# EAGLE design RomBoard (EAGLE 5.11)

## Sheet 1 of 2
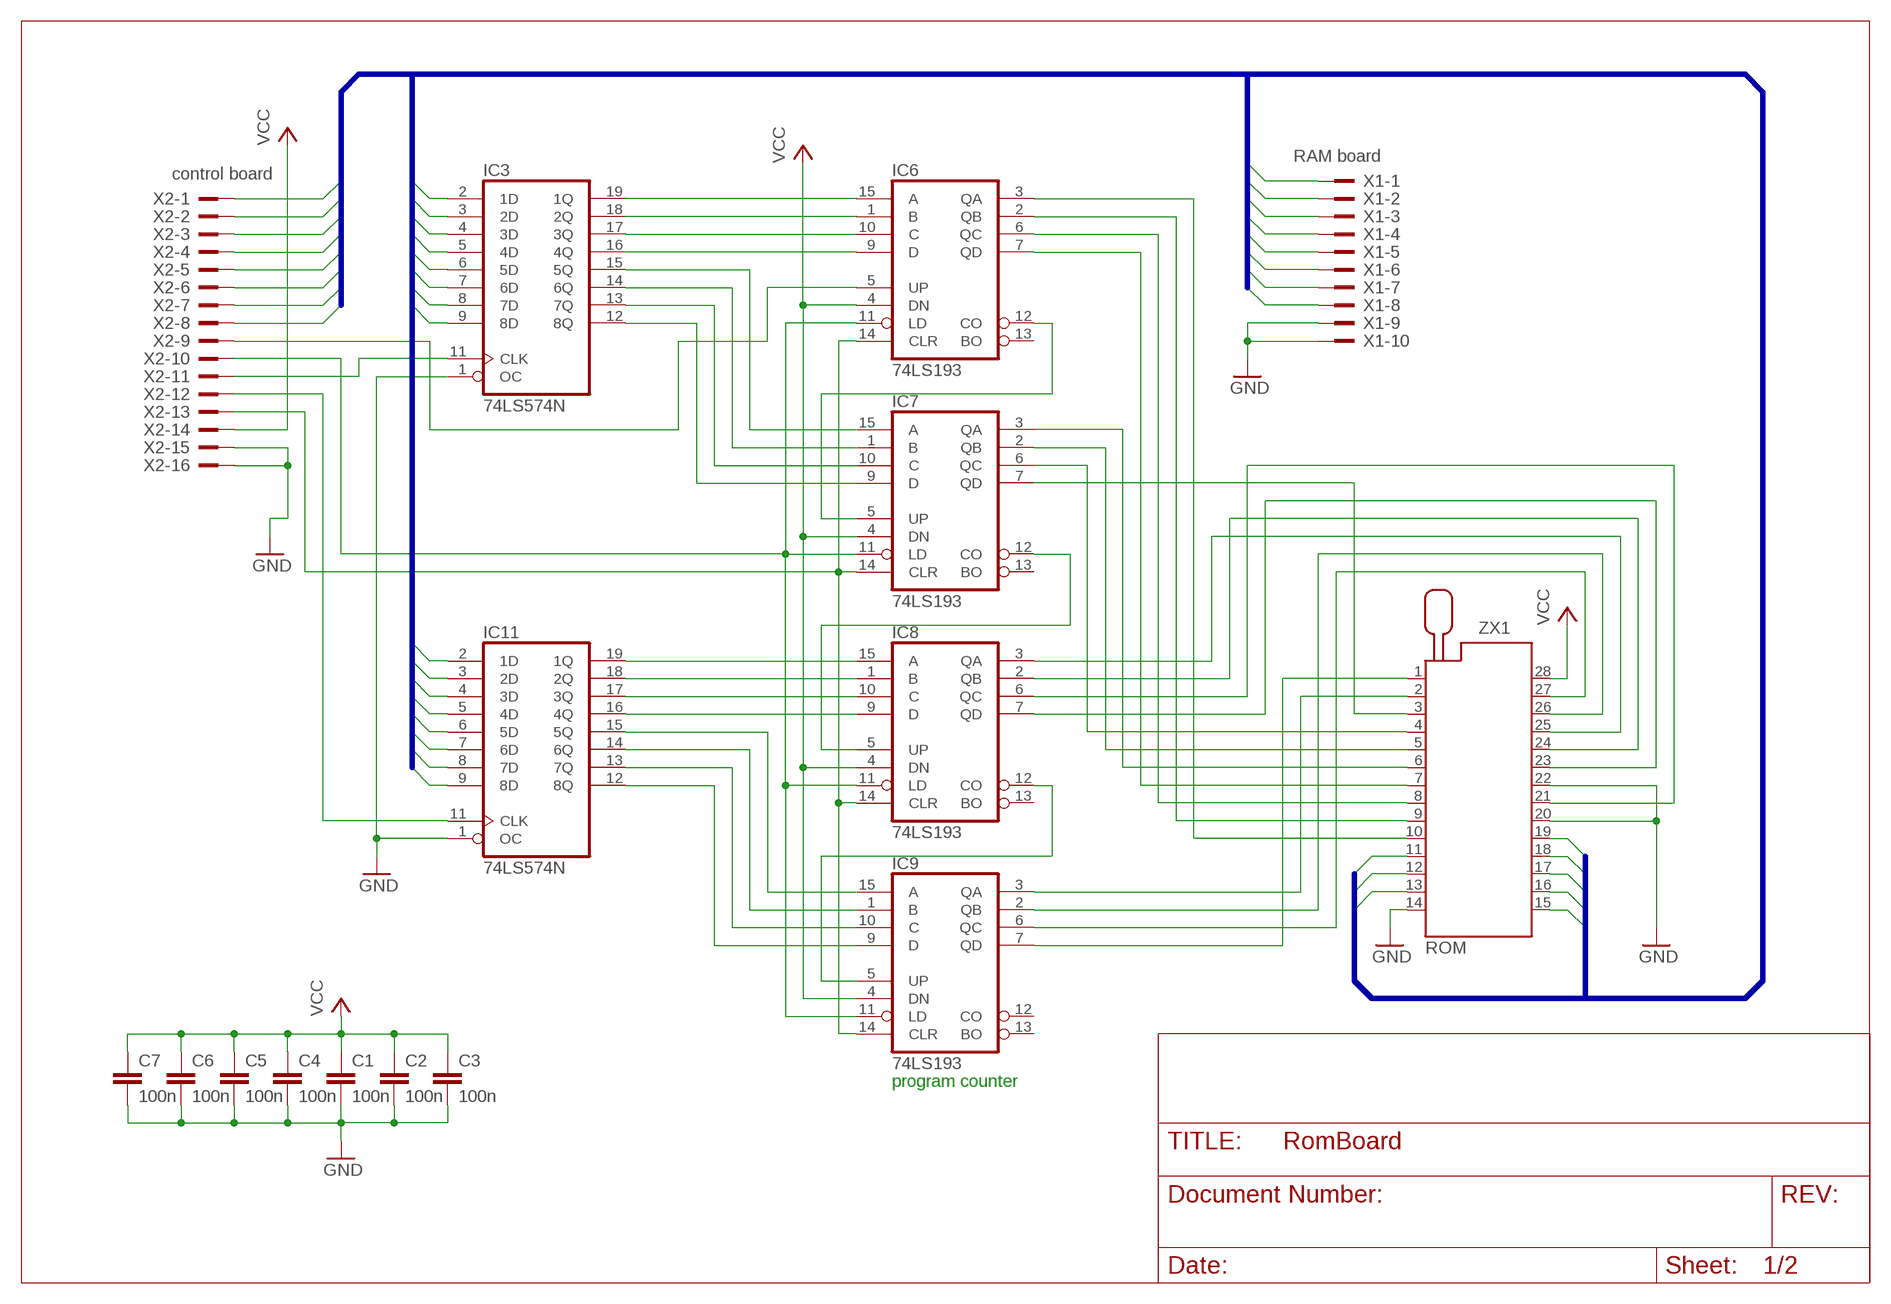
[diagram p0: schematic, sheet 1]

### Parts
C1  100n  C-EU050-025X075  [C050-025X075]
C2  100n  C-EU050-025X075  [C050-025X075]
C3  100n  C-EU050-025X075  [C050-025X075]
C4  100n  C-EU050-025X075  [C050-025X075]
C5  100n  C-EU050-025X075  [C050-025X075]
C6  100n  C-EU050-025X075  [C050-025X075]
C7  100n  C-EU050-025X075  [C050-025X075]
IC3  74LS574N  74AS574N  [DIL20]
IC6  74LS193  74192N  [DIL16]
IC7  74LS193  74192N  [DIL16]
IC8  74LS193  74192N  [DIL16]
IC9  74LS193  74192N  [DIL16]
IC11  74LS574N  74AS574N  [DIL20]
X1  RAM board  2510-  [PAK100/2500-10]
X2  control board  2516-  [PAK100/2500-16]
ZX1  ROM  228-1277-00-0602J  [228-1277-00-0602J]

### Nets
/LOAD_PC: IC6.11(LD) IC7.11(LD) IC8.11(LD) IC9.11(LD) X2.10
GND: C1.2 C2.2 C3.2 C4.2 C5.2 C6.2 C7.2 IC3.1(OC) IC11.1(OC) X1.9 X1.10 X2.15 X2.16 ZX1.14 ZX1.20 ZX1.22
INC_PC: IC6.5(UP) X2.9
LOAD_PCREG0: IC3.11(CLK) X2.11
LOAD_PCREG1: IC11.11(CLK) X2.12
N$15: IC6.12(CO) IC7.5(UP)
N$16: IC7.12(CO) IC8.5(UP)
N$22: IC8.12(CO) IC9.5(UP)
N$35: IC3.19(1Q) IC6.15(A)
N$36: IC3.18(2Q) IC6.1(B)
N$37: IC3.17(3Q) IC6.10(C)
N$38: IC3.16(4Q) IC6.9(D)
N$39: IC3.15(5Q) IC7.15(A)
N$40: IC3.14(6Q) IC7.1(B)
N$41: IC3.13(7Q) IC7.10(C)
N$42: IC3.12(8Q) IC7.9(D)
N$43: IC8.15(A) IC11.19(1Q)
N$44: IC8.1(B) IC11.18(2Q)
N$45: IC8.10(C) IC11.17(3Q)
N$46: IC8.9(D) IC11.16(4Q)
N$47: IC9.15(A) IC11.15(5Q)
N$48: IC9.1(B) IC11.14(6Q)
N$49: IC9.10(C) IC11.13(7Q)
N$50: IC9.9(D) IC11.12(8Q)
RESET: IC6.14(CLR) IC7.14(CLR) IC8.14(CLR) IC9.14(CLR) X2.13
ROM_A0: IC6.3(QA) ZX1.10
ROM_A1: IC6.2(QB) ZX1.9
ROM_A2: IC6.6(QC) ZX1.8
ROM_A3: IC6.7(QD) ZX1.7
ROM_A4: IC7.3(QA) ZX1.6
ROM_A5: IC7.2(QB) ZX1.5
ROM_A6: IC7.6(QC) ZX1.4
ROM_A7: IC7.7(QD) ZX1.3
ROM_A8: IC8.3(QA) ZX1.25
ROM_A9: IC8.2(QB) ZX1.24
ROM_A10: IC8.6(QC) ZX1.21
ROM_A11: IC8.7(QD) ZX1.23
ROM_A12: IC9.3(QA) ZX1.2
ROM_A13: IC9.2(QB) ZX1.26
ROM_A14: IC9.6(QC) ZX1.27
ROM_A15: IC9.7(QD) ZX1.1
ROM_O0: IC3.2(1D) IC11.2(1D) X1.1 X2.1 ZX1.11
ROM_O1: IC3.3(2D) IC11.3(2D) X1.2 X2.2 ZX1.12
ROM_O2: IC3.4(3D) IC11.4(3D) X1.3 X2.3 ZX1.13
ROM_O3: IC3.5(4D) IC11.5(4D) X1.4 X2.4 ZX1.15
ROM_O4: IC3.6(5D) IC11.6(5D) X1.5 X2.5 ZX1.16
ROM_O5: IC3.7(6D) IC11.7(6D) X1.6 X2.6 ZX1.17
ROM_O6: IC3.8(7D) IC11.8(7D) X1.7 X2.7 ZX1.18
ROM_O7: IC3.9(8D) IC11.9(8D) X1.8 X2.8 ZX1.19
VCC: C1.1 C2.1 C3.1 C4.1 C5.1 C6.1 C7.1 IC6.4(DN) IC7.4(DN) IC8.4(DN) IC9.4(DN) X2.14 ZX1.28
Unconnected: IC6.13(BO) IC7.13(BO) IC8.13(BO) IC9.12(CO) IC9.13(BO)

### Buses
ROM_O[0..7]

### Notes on the sheet
- program counter

## Sheet 2 of 2

## Power pins joined to a net without a drawn wire
GND: IC3.10(GND) IC6.8(GND) IC7.8(GND) IC8.8(GND) IC9.8(GND) IC11.10(GND)
VCC: IC3.20(VCC) IC6.16(VCC) IC7.16(VCC) IC8.16(VCC) IC9.16(VCC) IC11.20(VCC)

## Library data of the parts
C1-C7 = rcl:C-EU: CAPACITOR, European symbol
IC3 IC11 = 74xx-us:74*574: 8-bit D type FLIP FLOP bus driver
IC6-IC9 = 74xx-us:74*192: Synchronous 4-bit UP/DOWN COUNTER
X1 = con-3m:2510-: 3M (TM) Pak 100 4-Wall Header Source: 3M; MF: 3M; MPN: 2510-6002UB; OC_FARNELL: 9838244; OC_NEWARK: 46F4725
X2 = con-3m:2516-: 3M (TM) Pak 100 4-Wall Header Source: 3M; OC_FARNELL: unknown; OC_NEWARK: unknown
ZX1 = con-3m:228-?00-0602J: Zero Insertion Force Socked Source: http://www.3M.com/ehpd; MF: 3M; MPN: 228-1277-00-0602J; OC_FARNELL: 9897356; OC_NEWARK: 85K7825

## Board
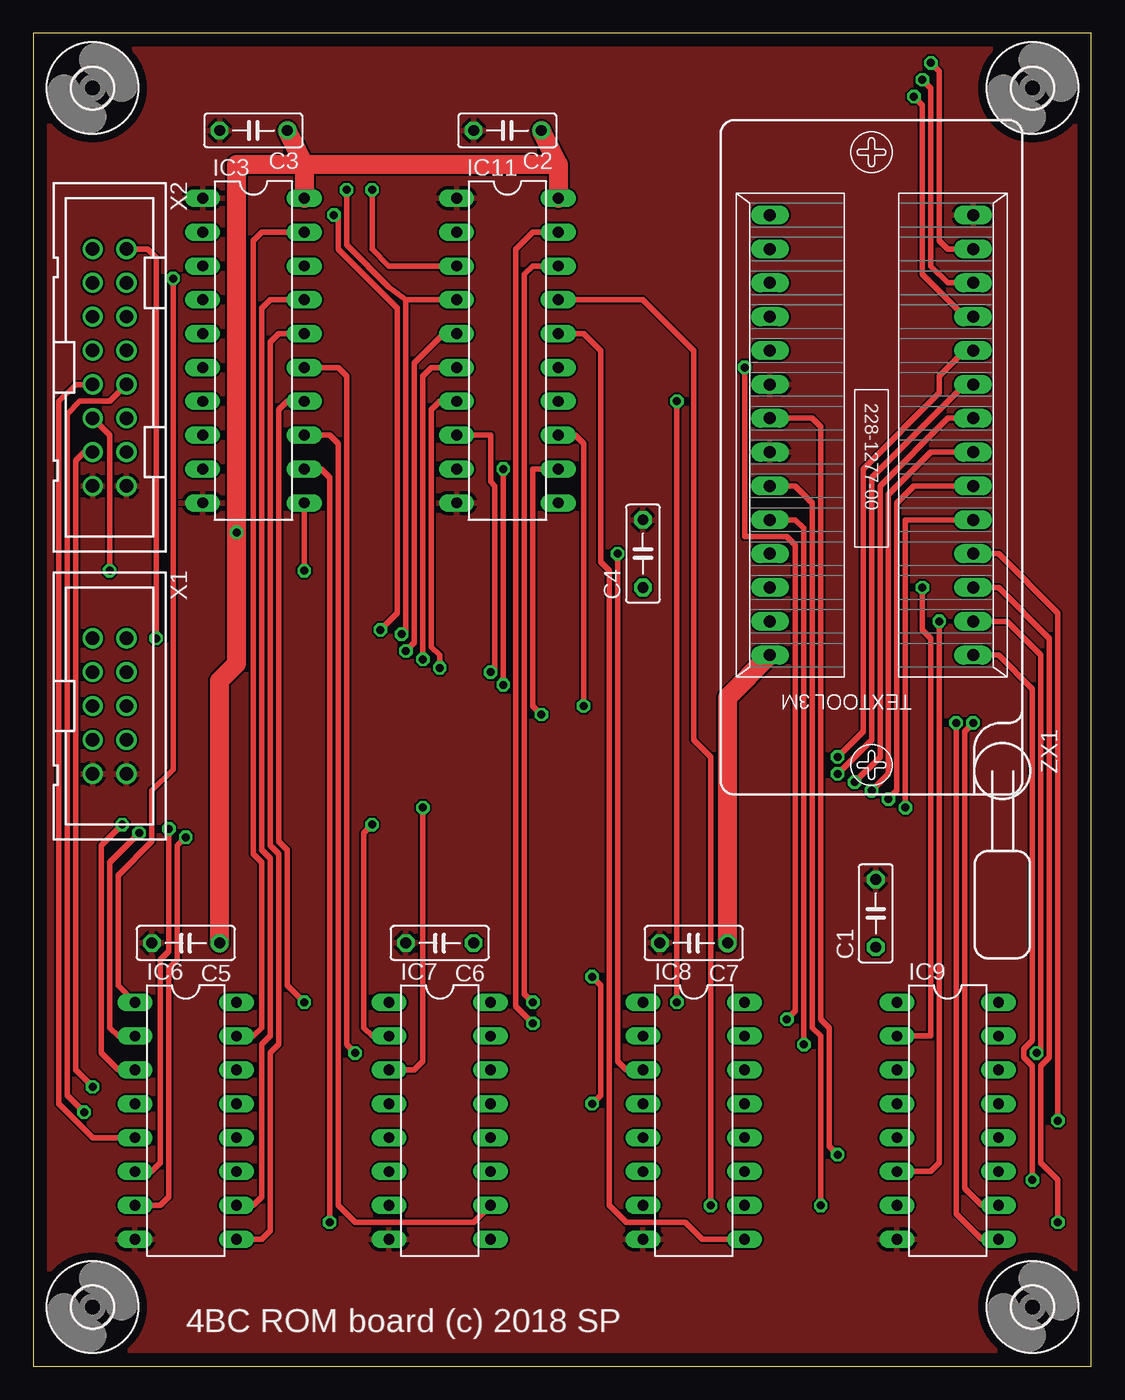
[diagram p1: board, top side]
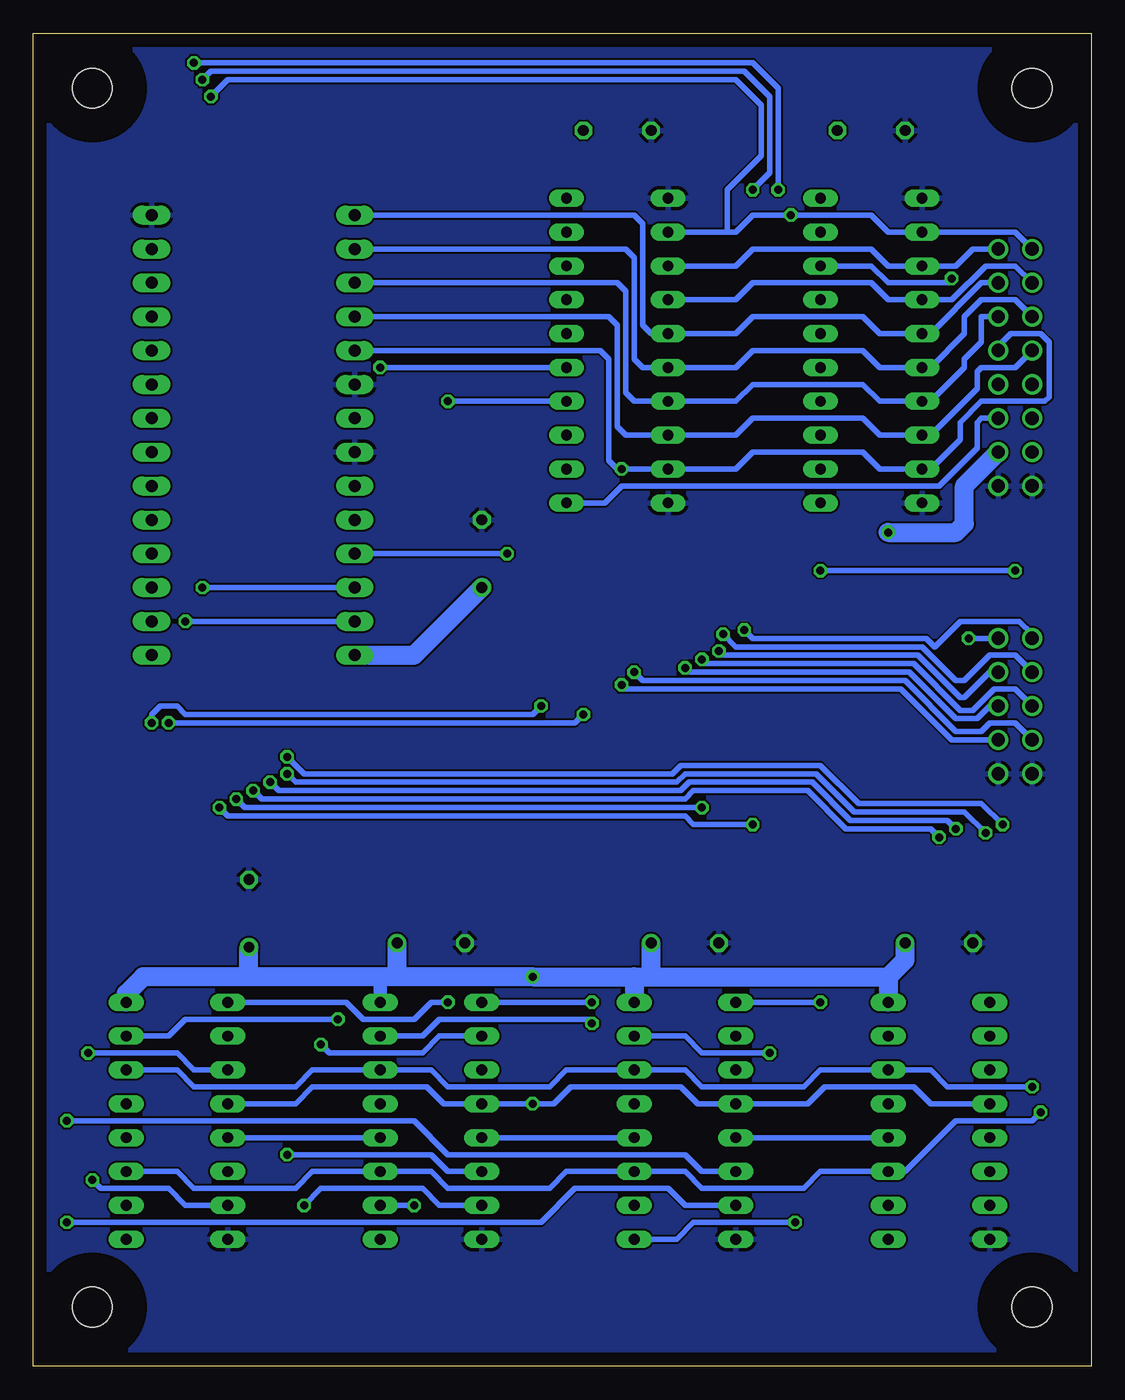
[diagram p2: board, bottom side, seen from below]

Size 79.36 x 100 mm. Coordinates in mm from the lower left corner, seen from the top.
Outline: 0,0 79.36,0 79.36,100 0,100 0,0
Copper layers (1*16): Top 0.035mm / dielectric 1.5mm / Bottom 0.035mm
Design rules "default *": minimum track width 10mil, minimum drill 16mil, track to track 6mil, track to pad 6mil, pad to pad 8mil, via to via 8mil, smd to smd 8mil, copper to edge 40mil, drill to drill 8mil, minimum pad ring 10mil, minimum via ring 8mil, stop-mask expansion 4mil, vias tented up to drill 0mil, thermal gap 10mil

### Footprints (pad centres in the part's own frame; a part is rotated, then mirrored left to right if it is on the bottom)
C050-025X075 = drill 0.813 octagon: 1 -2.54,0; 2 2.54,0
DIL20 = drill 0.813 long: 1 -11.43,-3.81; 2 -8.89,-3.81; 3 -6.35,-3.81; 4 -3.81,-3.81; 5 -1.27,-3.81; 6 1.27,-3.81; 7 3.81,-3.81; 8 6.35,-3.81; 9 8.89,-3.81; 10 11.43,-3.81; 11 11.43,3.81; 12 8.89,3.81; 13 6.35,3.81; 14 3.81,3.81; 15 1.27,3.81; 16 -1.27,3.81; 17 -3.81,3.81; 18 -6.35,3.81; 19 -8.89,3.81; 20 -11.43,3.81
DIL16 = drill 0.813 long: 1 -8.89,-3.81; 2 -6.35,-3.81; 3 -3.81,-3.81; 4 -1.27,-3.81; 5 1.27,-3.81; 6 3.81,-3.81; 7 6.35,-3.81; 8 8.89,-3.81; 9 8.89,3.81; 10 6.35,3.81; 11 3.81,3.81; 12 1.27,3.81; 13 -1.27,3.81; 14 -3.81,3.81; 15 -6.35,3.81; 16 -8.89,3.81
3,0 = hole 3: 0,0
PAK100/2500-10 = drill 1 pad 1.422 round: 1 -5.08,-1.27; 2 -5.08,1.27; 3 -2.54,-1.27; 4 -2.54,1.27; 5 0,-1.27; 6 0,1.27; 7 2.54,-1.27; 8 2.54,1.27; 9 5.08,-1.27; 10 5.08,1.27
PAK100/2500-16 = drill 1 pad 1.422 round: 1 -8.89,-1.27; 2 -8.89,1.27; 3 -6.35,-1.27; 4 -6.35,1.27; 5 -3.81,-1.27; 6 -3.81,1.27; 7 -1.27,-1.27; 8 -1.27,1.27; 9 1.27,-1.27; 10 1.27,1.27; 11 3.81,-1.27; 12 3.81,1.27; 13 6.35,-1.27; 14 6.35,1.27; 15 8.89,-1.27; 16 8.89,1.27
228-1277-00-0602J = drill 0.9 long: 1 -16.51,-7.62; 2 -13.97,-7.62; 3 -11.43,-7.62; 4 -8.89,-7.62; 5 -6.35,-7.62; 6 -3.81,-7.62; 7 -1.27,-7.62; 8 1.27,-7.62; 9 3.81,-7.62; 10 6.35,-7.62; 11 8.89,-7.62; 12 11.43,-7.62; 13 13.97,-7.62; 14 16.51,-7.62; 15 16.51,7.62; 16 13.97,7.62; 17 11.43,7.62; 18 8.89,7.62; 19 6.35,7.62; 20 3.81,7.62; 21 1.27,7.62; 22 -1.27,7.62; 23 -3.81,7.62; 24 -6.35,7.62; 25 -8.89,7.62; 26 -11.43,7.62; 27 -13.97,7.62; 28 -16.51,7.62

### Placement (x,y rotation side)
C1  63.18,33.97 90 top
C2  35.56,92.71 180 top
C3  16.51,92.71 180 top
C4  45.72,60.96 90 top
C5  11.43,31.75 180 top
C6  30.48,31.75 180 top
C7  49.53,31.75 180 top
IC3  16.51,76.2 270 top
IC6  11.43,18.41 270 top
IC7  30.48,18.41 270 top
IC8  49.53,18.41 270 top
IC9  68.58,18.41 270 top
IC11  35.56,76.2 270 top
U$1  [3,0]  4.45,95.89 0 top
U$2  [3,0]  74.93,95.89 0 top
U$3  [3,0]  74.93,4.45 0 top
U$4  [3,0]  4.45,4.45 0 top
X1  5.71,49.53 270 top
X2  5.71,74.93 270 top
ZX1  62.87,69.85 90 top

### Tracks (layer width: path | path; a pad name or v marks a point on that pad's centre or on a via)
/LOAD_PC  (via drill 0.6)
  Top 0.406: v3.81,19.05 2.54,20.32 2.54,71.44 3.49,72.39 5.71,72.39 X2.10
  Bottom 0.406: IC9.11 68.58,14.61 67.31,13.34 59.69,13.34 58.42,14.61 IC8.11 49.53,14.61 48.26,13.34 40.64,13.34 39.37,14.61 IC7.11 30.48,14.61 29.21,13.34 21.59,13.34 20.32,14.61 IC6.11 13.97,14.61 10.16,18.41 4.45,18.41 v3.81,19.05
GND
  pour Bottom: 0,0 79.38,0 79.38,99.69 0,99.69
  pour Top: 0,99.69 79.38,99.69 79.38,0 0,0
INC_PC
  Top 0.406: IC6.5 4.45,17.14 1.91,19.68 1.91,72.39 3.17,73.66 X2.9
LOAD_PCREG0  (via drill 0.6)
  Top 0.406: v20.32,59.69 IC3.11 | X2.11 5.71,69.85 v5.71,59.69
  Bottom 0.406: v5.71,59.69 v20.32,59.69
LOAD_PCREG1
  Bottom 0.406: IC11.11 36.51,64.77 35.24,66.04 11.43,66.04 8.57,68.9 8.57,70.8 8.26,71.12 X2.12
N$15
  Bottom 0.406: IC6.12 IC7.5
N$16
  Bottom 0.406: IC7.12 IC8.5
N$22
  Bottom 0.406: IC8.12 IC9.5
N$35
  Top 0.406: IC3.19 17.14,85.09 16.51,84.45 16.51,38.42 17.14,37.78 17.14,25.4 16.51,24.77 IC6.15
N$36  (via drill 0.6)
  Top 0.406: v10.48,81.6 10.48,44.77 8.89,43.18 8.89,39.37 6.35,36.83 6.35,28.57 IC6.1
  Bottom 0.406: IC3.18 16.51,82.55 15.24,81.28 10.79,81.28 v10.48,81.6
N$37
  Top 0.406: IC6.10 16.51,12.06 17.14,12.7 17.14,24.13 17.78,24.77 17.78,38.1 17.14,38.73 17.14,79.38 17.78,80.01 IC3.17
N$38
  Top 0.406: IC6.9 17.14,9.53 17.78,10.16 17.78,23.5 18.41,24.13 18.41,38.42 17.78,39.05 17.78,76.83 18.41,77.47 IC3.16
N$39  (via drill 0.6)
  Top 0.406: v24.13,23.5 23.5,24.13 23.5,74.3 22.86,74.93 IC3.15
  Bottom 0.406: IC7.15 30.48,24.77 29.21,23.5 v24.13,23.5
N$40  (via drill 0.6)
  Top 0.406: v20.32,27.3 19.05,28.57 19.05,38.73 18.41,39.37 18.41,71.75 19.05,72.39 IC3.14
  Bottom 0.406: v20.32,27.3 IC7.1
N$41
  Top 0.406: IC3.13 22.23,69.85 22.86,69.22 22.86,12.06 24.13,10.79 33.02,10.79 IC7.10
N$42  (via drill 0.6)
  Top 0.406: v22.23,10.79 22.23,66.67 21.59,67.31 IC3.12
  Bottom 0.406: IC7.9 31.11,9.53 29.84,10.79 v22.23,10.79
N$43  (via drill 0.6)
  Top 0.406: v37.47,25.72 36.2,26.99 36.2,83.82 37.47,85.09 IC11.19
  Bottom 0.406: IC8.15 50.16,24.77 48.9,26.04 37.78,26.04 v37.47,25.72
N$44  (via drill 0.6)
  Top 0.406: v37.47,27.3 36.83,27.94 36.83,81.92 37.47,82.55 IC11.18
  Bottom 0.406: v37.47,27.3 IC8.1
N$45  (via drill 0.6)
  Top 0.406: v50.8,12.06 50.8,45.72 49.53,46.99 49.53,76.2 45.72,80.01 IC11.17
  Bottom 0.406: v50.8,12.06 IC8.10
N$46
  Top 0.406: IC8.9 50.16,9.53 48.9,10.79 44.45,10.79 43.18,12.06 43.18,59.69 42.55,60.33 42.55,76.2 41.27,77.47 IC11.16
N$47  (via drill 0.6)
  Top 0.406: v56.52,26.04 57.15,26.67 57.15,61.59 56.52,62.23 53.34,62.23 v53.34,74.93
  Bottom 0.406: IC9.15 69.22,24.77 67.94,26.04 v56.52,26.04 | v53.34,74.93 IC11.15
N$48  (via drill 0.6)
  Top 0.406: v48.26,27.3 v48.26,72.39
  Bottom 0.406: IC9.1 55.88,27.3 54.61,26.04 50.8,26.04 49.53,27.3 v48.26,27.3 | v48.26,72.39 IC11.14
N$49  (via drill 0.6)
  Top 0.406: IC9.10 71.12,12.06 69.85,13.34 69.85,47.62 v70.48,48.26 | IC11.13 40.64,69.85 41.27,69.22 v41.27,49.53
  Bottom 0.406: v41.27,49.53 41.91,48.9 67.94,48.9 68.58,49.53 69.85,49.53 70.48,48.9 v70.48,48.26
N$50  (via drill 0.6)
  Top 0.406: IC9.9 71.12,9.53 69.22,11.43 v69.22,48.26 | v38.1,48.9 37.47,49.53 37.47,67.31 IC11.12
  Bottom 0.406: v69.22,48.26 38.73,48.26 v38.1,48.9
RESET  (via drill 0.6)
  Top 0.406: X2.13 3.81,68.58 3.17,67.94 3.17,22.23 v4.45,20.95
  Bottom 0.406: IC9.14 68.58,22.23 67.31,20.95 59.69,20.95 58.42,22.23 IC8.14 49.53,22.23 48.26,20.95 40.64,20.95 39.37,22.23 IC7.14 30.48,22.23 29.21,20.95 21.59,20.95 20.32,22.23 IC6.14 12.06,22.23 10.79,20.95 v4.45,20.95
ROM_A0  (via drill 0.6)
  Top 0.406: v60.33,45.72 62.23,47.62 62.23,67.31 67.94,73.03 67.94,74.3 69.85,76.2 ZX1.10 | IC6.3 6.35,22.23 5.08,23.5 5.08,39.05 v6.67,40.64
  Bottom 0.406: v60.33,45.72 59.05,44.45 31.43,44.45 30.8,45.09 20.32,45.09 17.46,42.23 8.26,42.23 v6.67,40.64
ROM_A1  (via drill 0.6)
  Top 0.406: v60.33,44.45 62.87,46.99 62.87,66.67 69.85,73.66 ZX1.9 | IC6.2 6.35,24.77 5.71,25.4 5.71,37.78 v7.94,40.01
  Bottom 0.406: v60.33,44.45 59.69,43.81 31.11,43.81 30.48,44.45 20.64,44.45 17.78,41.59 9.53,41.59 v7.94,40.01
ROM_A2  (via drill 0.6)
  Top 0.406: v61.59,43.81 63.5,45.72 63.5,66.04 68.58,71.12 ZX1.8 | IC6.6 8.89,14.61 9.53,15.24 9.53,30.48 10.16,31.11 v10.16,40.32
  Bottom 0.406: v61.59,43.81 60.96,43.18 30.8,43.18 30.16,43.81 20.95,43.81 18.1,40.96 10.79,40.96 v10.16,40.32
ROM_A3  (via drill 0.6)
  Top 0.406: v62.87,43.18 64.14,44.45 64.14,65.41 67.31,68.58 ZX1.7 | IC6.7 9.53,12.06 10.16,12.7 10.16,29.84 10.79,30.48 10.79,39.05 v11.43,39.69
  Bottom 0.406: v62.87,43.18 62.23,42.55 30.48,42.55 29.84,43.18 21.27,43.18 18.41,40.32 12.06,40.32 v11.43,39.69
ROM_A4  (via drill 0.6)
  Top 0.406: v64.14,42.55 64.77,43.18 64.77,64.77 66.04,66.04 ZX1.6 | IC7.3 28.57,22.23 29.21,22.86 v29.21,41.91
  Bottom 0.406: v64.14,42.55 63.5,41.91 v29.21,41.91
ROM_A5  (via drill 0.6)
  Top 0.406: v65.41,41.91 65.41,63.5 ZX1.5 | IC7.2 25.4,24.77 24.77,25.4 24.77,40.01 v25.4,40.64
  Bottom 0.406: v65.41,41.91 64.77,41.27 30.48,41.27 29.84,40.64 v25.4,40.64
ROM_A6  (via drill 0.6)
  Top 0.406: v76.83,18.41 76.83,56.52 72.39,60.96 ZX1.4
  Bottom 0.406: IC7.6 29.21,14.61 30.48,15.88 48.26,15.88 50.8,18.41 v76.83,18.41
ROM_A7  (via drill 0.6)
  Top 0.406: v76.83,10.79 76.83,13.97 75.56,15.24 75.56,22.54 76.2,23.18 76.2,54.61 72.39,58.42 ZX1.3
  Bottom 0.406: IC7.7 30.48,12.06 31.75,13.34 38.73,13.34 41.27,10.79 v76.83,10.79
ROM_A8  (via drill 0.6)
  Top 0.406: v43.81,60.96 43.81,22.86 44.45,22.23 IC8.3
  Bottom 0.406: v43.81,60.96 ZX1.25
ROM_A9  (via drill 0.6)
  Top 0.406: v57.78,24.13 57.78,62.87 57.15,63.5 ZX1.24
  Bottom 0.406: IC8.2 48.9,24.77 50.16,23.5 57.15,23.5 v57.78,24.13
ROM_A10  (via drill 0.6)
  Top 0.406: v60.33,15.88 59.69,16.51 59.69,25.4 59.05,26.04 59.05,70.48 58.42,71.12 ZX1.21
  Bottom 0.406: v60.33,15.88 49.53,15.88 48.26,14.61 IC8.6
ROM_A11  (via drill 0.6)
  Top 0.406: v59.05,12.06 59.05,24.77 58.42,25.4 58.42,64.77 57.15,66.04 ZX1.23
  Bottom 0.406: IC8.7 48.9,12.06 50.16,13.34 57.78,13.34 v59.05,12.06
ROM_A12  (via drill 0.6)
  Top 0.406: v75.25,23.5 75.56,23.81 75.56,53.34 73.03,55.88 ZX1.2
  Bottom 0.406: v75.25,23.5 68.58,23.5 67.31,22.23 IC9.3
ROM_A13  (via drill 0.6)
  Top 0.406: v66.67,58.42 66.67,55.24 67.31,54.61 67.31,24.77 IC9.2
  Bottom 0.406: v66.67,58.42 ZX1.26
ROM_A14  (via drill 0.6)
  Top 0.406: v67.94,55.88 67.94,15.24 67.31,14.61 IC9.6
  Bottom 0.406: v67.94,55.88 ZX1.27
ROM_A15  (via drill 0.6)
  Top 0.406: v74.93,13.97 74.93,22.54 74.3,23.18 74.3,23.81 74.93,24.45 74.93,50.8 72.39,53.34 ZX1.1
  Bottom 0.406: IC9.7 67.94,12.06 69.22,13.34 74.3,13.34 v74.93,13.97
ROM_O0  (via drill 0.6)
  Top 0.406: v66.04,95.25 66.67,94.61 66.67,81.92 69.85,78.74 ZX1.11 | v26.04,55.24 27.3,56.52 27.3,79.38 22.86,83.82 22.86,86.04 v22.54,86.36
  Bottom 0.406: 27.3,85.09 26.67,85.09 25.4,86.36 v22.54,86.36 16.51,86.36 15.24,85.09 IC3.2 5.71,85.09 X2.1 | 27.3,85.09 IC11.2 | v66.04,95.25 64.77,96.52 26.67,96.52 24.77,94.61 24.77,90.81 27.3,88.27 27.3,85.09 | X1.1 4.45,54.93 5.4,55.88 9.84,55.88 11.75,53.98 12.38,54.61 25.4,54.61 v26.04,55.24
ROM_O1  (via drill 0.6)
  Top 0.406: v66.67,96.52 67.31,95.89 67.31,82.55 68.58,81.28 ZX1.12 | v25.4,88.27 25.4,83.82 26.67,82.55 IC11.3 | v9.21,54.61 9.21,83.19 8.57,83.82 X2.2
  Bottom 0.406: IC11.3 26.67,82.55 25.4,83.82 16.51,83.82 15.24,82.55 IC3.3 10.16,82.55 8.89,83.82 X2.2 | v66.67,96.52 66.04,97.16 26.04,97.16 24.13,95.25 24.13,89.53 v25.4,88.27 | X1.2 v9.21,54.61
ROM_O2  (via drill 0.6)
  Top 0.406: v67.31,97.79 67.94,97.16 67.94,84.45 68.58,83.82 ZX1.13 | v23.5,88.27 23.5,84.14 26.67,80.96 27.94,80.01 | 27.94,80.01 IC11.4 | 27.94,80.01 27.94,55.24 v27.62,54.93
  Bottom 0.406: IC11.4 26.67,80.01 25.4,81.28 16.51,81.28 15.24,80.01 IC3.4 10.48,80.01 7.94,82.55 5.71,82.55 X2.3 | v67.31,97.79 25.4,97.79 23.5,95.89 v23.5,88.27 | X1.3 5.71,53.34 7.62,53.34 9.53,51.44 10.16,51.44 12.7,53.98 26.67,53.98 v27.62,54.93
ROM_O3  (via drill 0.6)
  Top 0.406: IC11.5 30.8,77.47 28.57,75.25 28.57,54.29 v27.94,53.66
  Bottom 0.406: X2.4 8.26,81.28 12.06,77.47 IC3.5 15.88,77.47 17.14,78.74 25.4,78.74 26.67,77.47 IC11.5 33.02,77.47 33.66,78.11 33.66,85.72 34.29,86.36 ZX1.15 | X1.4 7.62,52.07 9.53,50.16 9.84,50.16 13.02,53.34 27.62,53.34 v27.94,53.66
ROM_O4  (via drill 0.6)
  Top 0.406: v29.21,53.02 29.21,74.3 29.84,74.93 IC11.6
  Bottom 0.406: X2.5 5.71,80.01 8.26,80.01 9.53,78.74 9.53,77.47 12.06,74.93 IC3.6 15.88,74.93 17.14,76.2 25.4,76.2 26.67,74.93 IC11.6 33.66,74.93 34.29,75.56 34.29,83.19 34.92,83.82 ZX1.16 | X1.5 5.71,50.8 7.3,50.8 8.89,49.21 9.84,49.21 13.34,52.7 28.89,52.7 v29.21,53.02
ROM_O5  (via drill 0.6)
  Top 0.406: v30.48,52.39 30.48,53.34 29.84,53.98 29.84,71.75 30.48,72.39 IC11.7
  Bottom 0.406: X2.6 8.26,78.74 8.26,76.83 9.53,75.56 9.53,74.93 12.06,72.39 IC3.7 15.88,72.39 17.14,73.66 25.4,73.66 26.67,72.39 IC11.7 34.29,72.39 34.92,73.03 34.92,80.64 35.56,81.28 ZX1.17 | X1.6 7.62,49.53 8.57,48.58 10.16,48.58 13.65,52.07 30.16,52.07 v30.48,52.39
ROM_O6  (via drill 0.6)
  Top 0.406: v34.29,52.07 34.61,52.39 34.61,66.04 34.29,66.36 34.29,69.85 IC11.8
  Bottom 0.406: X2.7 5.71,74.93 8.26,74.93 8.57,74.61 8.57,73.34 12.06,69.85 IC3.8 15.88,69.85 17.14,71.12 25.4,71.12 26.67,69.85 IC11.8 34.92,69.85 35.56,70.48 35.56,78.11 36.2,78.74 ZX1.18 | X1.7 5.71,48.26 7.62,48.26 8.26,47.62 10.16,47.62 13.97,51.44 33.66,51.44 v34.29,52.07
ROM_O7  (via drill 0.6)
  Top 0.406: v35.24,51.12 v35.24,67.31
  Bottom 0.406: X2.8 6.99,76.52 6.03,77.47 3.81,77.47 3.17,76.83 3.17,72.71 3.49,72.39 8.26,72.39 9.84,70.8 9.84,69.53 12.06,67.31 IC3.9 15.88,67.31 17.14,68.58 25.4,68.58 26.67,67.31 IC11.9 v35.24,67.31 35.56,67.31 36.2,67.94 36.2,75.56 36.83,76.2 ZX1.19 | X1.8 10.48,46.99 14.29,50.8 34.92,50.8 v35.24,51.12
VCC  (via drill 0.6)
  Top 0.406: v41.91,19.68 42.55,20.32 42.55,28.57 v41.91,29.21
  Top 1.422: 39.37,90.17 IC11.20 | 39.37,90.17 C2.1 | 20.32,90.17 C3.1 | 20.32,90.17 IC3.20 | 20.32,90.17 39.37,90.17 | 20.32,90.17 15.24,90.17 v15.24,62.55 15.24,52.7 13.97,51.44 C5.1 | C7.1 52.07,50.16 ZX1.28
  Bottom 0.406: IC6.4 12.06,19.68 13.34,20.95 20,20.95 21.27,19.68 IC7.4 29.53,19.68 30.8,20.95 39.05,20.95 40.32,19.68 v41.91,19.68 IC8.4 48.58,19.68 49.85,20.95 58.42,20.95 59.69,19.68 IC9.4
  Bottom 1.016: 53.34,29.21 IC8.16
  Bottom 1.422: IC9.16 72.39,27.94 71.12,29.21 63.18,29.21 | 63.18,29.21 53.34,29.21 52.07,29.21 | 34.29,29.21 v41.91,29.21 52.07,29.21 | 34.29,29.21 IC7.16 | 34.29,29.21 33.02,29.21 | 33.02,29.21 15.24,29.21 | 15.24,29.21 IC6.16 | 33.02,29.21 C6.1 | 52.07,29.21 C7.1 | 63.18,29.21 C1.1 | C5.1 13.97,30.48 15.24,29.21 | C4.1 50.8,53.34 ZX1.28 | X2.14 9.53,66.04 9.53,63.18 10.16,62.55 v15.24,62.55

### Text on the board
tNames: 4BC ROM board (c) 2018 SP